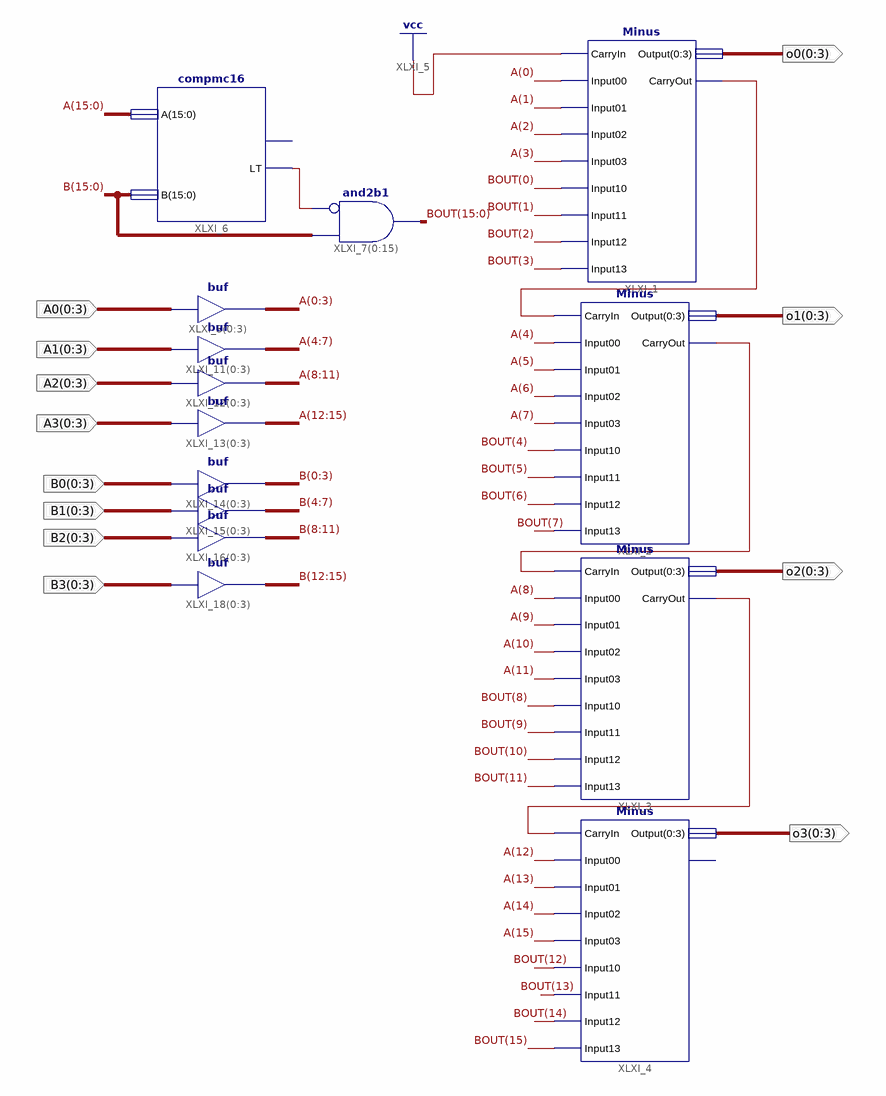
[diagram p0: schematic sheet 1]
// Xilinx ISE schematic Minuss.sch (spartan6) as structural Verilog: 14 symbols, 12 ports
module Minuss (
  input  [0:3] A0,
  input  [0:3] A1,
  input  [0:3] A2,
  input  [0:3] A3,
  input  [0:3] B0,
  input  [0:3] B1,
  input  [0:3] B2,
  input  [0:3] B3,
  output [0:3] o0,
  output [0:3] o1,
  output [0:3] o2,
  output [0:3] o3
);

  wire XLXN_8, XLXN_9, XLXN_10, XLXN_60;
  wire [15:0] A, B, BOUT;

  Minus XLXI_1 (
    .CarryIn(1'b1), .CarryOut(XLXN_8), .Input00(A[0]), .Input01(A[1]), .Input02(A[2]), .Input03(A[3]),
    .Input10(BOUT[0]), .Input11(BOUT[1]), .Input12(BOUT[2]), .Input13(BOUT[3]), .Output(o0));
  Minus XLXI_2 (
    .CarryIn(XLXN_8), .CarryOut(XLXN_9), .Input00(A[4]), .Input01(A[5]), .Input02(A[6]), .Input03(A[7]),
    .Input10(BOUT[4]), .Input11(BOUT[5]), .Input12(BOUT[6]), .Input13(BOUT[7]), .Output(o1));
  Minus XLXI_4 (
    .CarryIn(XLXN_10), .Input00(A[12]), .Input01(A[13]), .Input02(A[14]), .Input03(A[15]),
    .Input10(BOUT[12]), .Input11(BOUT[13]), .Input12(BOUT[14]), .Input13(BOUT[15]), .Output(o3));  // open: CarryOut
  compmc16 XLXI_6 (.A(A), .B(B), .LT(XLXN_60));  // open: GT
  assign BOUT = ~{16{XLXN_60}} & B;  // and2b1 XLXI_7[0..15], 16 bits wide
  assign {A[0], A[1], A[2], A[3]} = A0;  // buf XLXI_8[0..3], 4 bits wide
  assign {A[4], A[5], A[6], A[7]} = A1;  // buf XLXI_11[0..3], 4 bits wide
  assign {A[8], A[9], A[10], A[11]} = A2;  // buf XLXI_12[0..3], 4 bits wide
  assign {A[12], A[13], A[14], A[15]} = A3;  // buf XLXI_13[0..3], 4 bits wide
  assign {B[0], B[1], B[2], B[3]} = B0;  // buf XLXI_14[0..3], 4 bits wide
  assign {B[4], B[5], B[6], B[7]} = B1;  // buf XLXI_15[0..3], 4 bits wide
  assign {B[8], B[9], B[10], B[11]} = B2;  // buf XLXI_16[0..3], 4 bits wide
  assign {B[12], B[13], B[14], B[15]} = B3;  // buf XLXI_18[0..3], 4 bits wide
  Minus XLXI_3 (
    .CarryIn(XLXN_9), .CarryOut(XLXN_10), .Input00(A[8]), .Input01(A[9]), .Input02(A[10]), .Input03(A[11]),
    .Input10(BOUT[8]), .Input11(BOUT[9]), .Input12(BOUT[10]), .Input13(BOUT[11]), .Output(o2));
endmodule
